# Altium project PCB_Project_1.PrjPcb
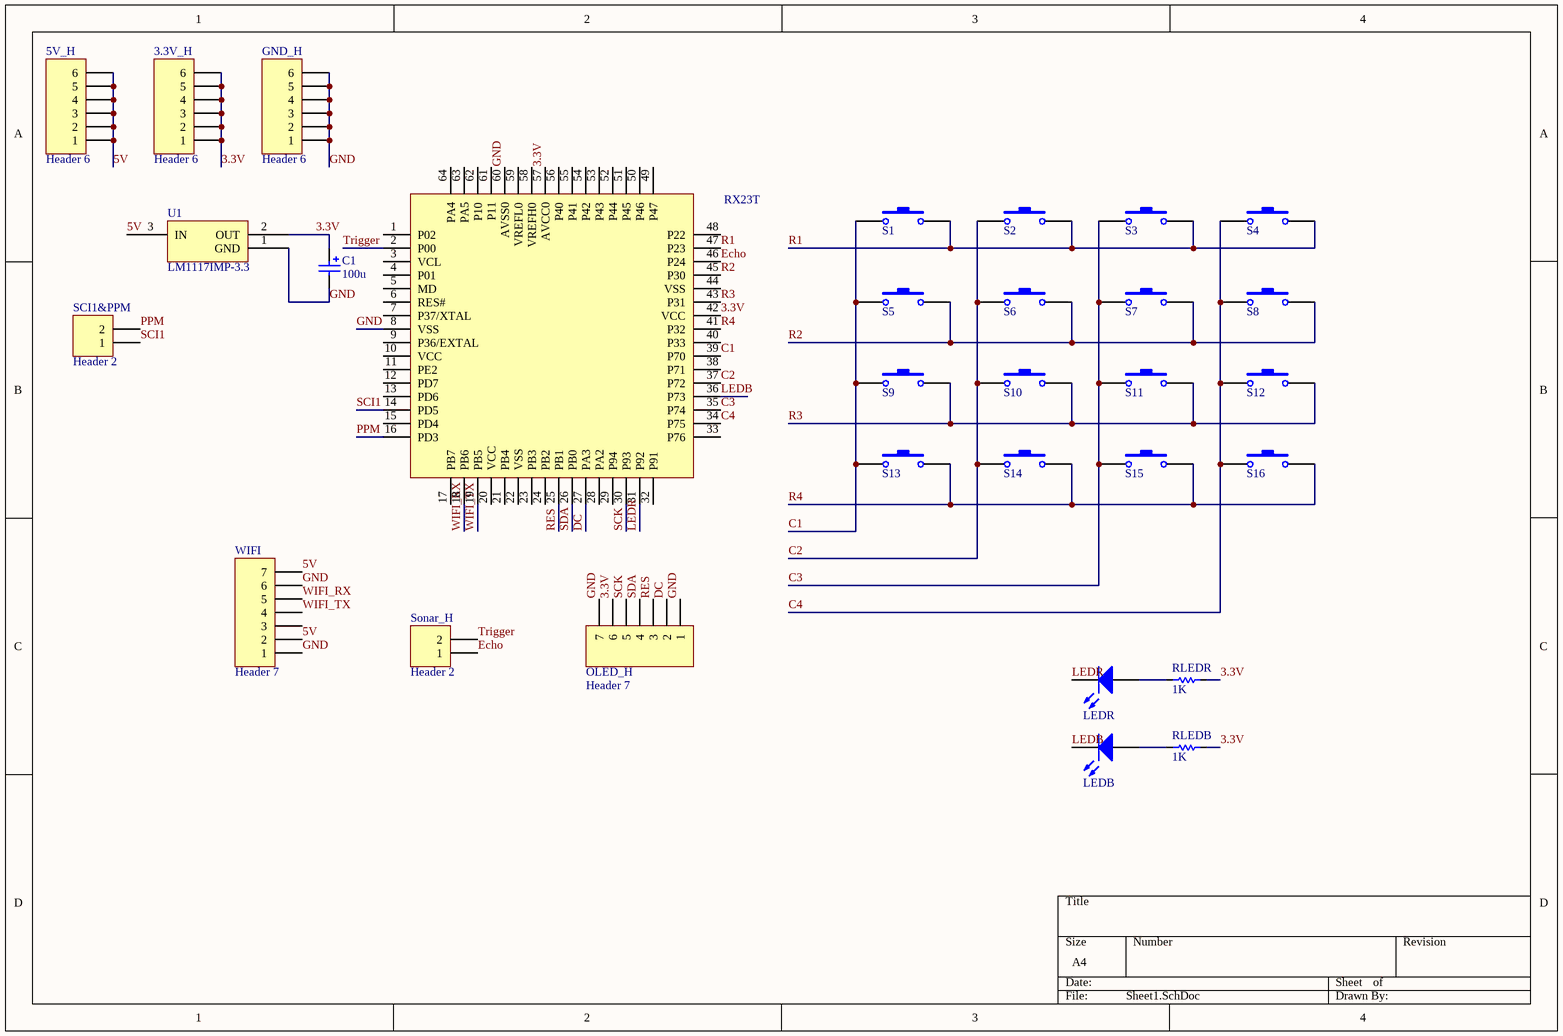
[diagram p0: Sheet1.SchDoc]
1 sheet, 30 parts. Net scope: global (net labels, ports and power ports of the same name join across sheets).
Board file: PCB1.PcbDoc

## Sheet Sheet1.SchDoc
size A4

### Parts
3.3V_H  Header 6  [HDR1X6]
5V_H  Header 6  [HDR1X6]
C1  value 100u  [CAP 2.5*5*11]  (hidden comment: Cap Pol3)
GND_H  Header 6  [HDR1X6]
LEDB  LED  [LED 3MM-R]  (value not drawn)
LEDR  LED  [LED 3MM-R]  (value not drawn)
OLED_H  Header 7  [HDR1X7]
RLEDB  1K  [RS 1/4W]
RLEDR  1K  [RS 1/4W]
RX23T  RX23T  [RFR]  (value not drawn)
S1  贴片轻触开关  [SW-6*6]  (value not drawn)
S2  贴片轻触开关  [SW-6*6]  (value not drawn)
S3  贴片轻触开关  [SW-6*6]  (value not drawn)
S4  贴片轻触开关  [SW-6*6]  (value not drawn)
S5  贴片轻触开关  [SW-6*6]  (value not drawn)
S6  贴片轻触开关  [SW-6*6]  (value not drawn)
S7  贴片轻触开关  [SW-6*6]  (value not drawn)
S8  贴片轻触开关  [SW-6*6]  (value not drawn)
S9  贴片轻触开关  [SW-6*6]  (value not drawn)
S10  贴片轻触开关  [SW-6*6]  (value not drawn)
S11  贴片轻触开关  [SW-6*6]  (value not drawn)
S12  贴片轻触开关  [SW-6*6]  (value not drawn)
S13  贴片轻触开关  [SW-6*6]  (value not drawn)
S14  贴片轻触开关  [SW-6*6]  (value not drawn)
S15  贴片轻触开关  [SW-6*6]  (value not drawn)
S16  贴片轻触开关  [SW-6*6]  (value not drawn)
SCI1&PPM  Header 2  [HDR1X2]
Sonar_H  Header 2  [HDR1X2]
U1  LM1117IMP-3.3  [SOT223_M]
WIFI  Header 7  [HDR1X7]

### Nets
3.3V: 3.3V_H.1 3.3V_H.2 3.3V_H.3 3.3V_H.4 3.3V_H.5 3.3V_H.6 C1.1 OLED_H.6 RLEDB.2 RLEDR.2 RX23T.42(VCC) RX23T.57(AVCC0) U1.2(OUT)
5V: 5V_H.1 5V_H.2 5V_H.3 5V_H.4 5V_H.5 5V_H.6 U1.3(IN) WIFI.2 WIFI.7
C1: RX23T.39(P70) S1.1 S5.1 S9.1 S13.1
C2: RX23T.37(P72) S2.1 S6.1 S10.1 S14.1
C3: RX23T.35(P74) S3.1 S7.1 S11.1 S15.1
C4: RX23T.34(P75) S4.1 S8.1 S12.1 S16.1
DC: OLED_H.2 RX23T.27(PA3)
Echo: RX23T.46(P24) Sonar_H.1
GND: C1.2 GND_H.1 GND_H.2 GND_H.3 GND_H.4 GND_H.5 GND_H.6 OLED_H.1 OLED_H.7 RX23T.8(VSS) RX23T.60(AVSS0) U1.1(GND) WIFI.1 WIFI.6
LEDB: LEDB.2 RX23T.36(P73)
LEDR: LEDR.2 RX23T.31(P92)
PPM: RX23T.16(PD3) SCI1&PPM.2
R1: RX23T.47(P23) S1.2 S2.2 S3.2 S4.2
R2: RX23T.45(P30) S5.2 S6.2 S7.2 S8.2
R3: RX23T.43(P31) S9.2 S10.2 S11.2 S12.2
R4: RX23T.41(P32) S13.2 S14.2 S15.2 S16.2
RES: OLED_H.3 RX23T.25(PB1)
SCI1: RX23T.14(PD5) SCI1&PPM.1
SCK: OLED_H.5 RX23T.30(P93)
SDA: OLED_H.4 RX23T.26(PB0)
Trigger: RX23T.2(P00) Sonar_H.2
WIFI_RX: RX23T.18(PB6) WIFI.5
WIFI_TX: RX23T.19(PB5) WIFI.4
NetLEDB_1: LEDB.1 RLEDB.1
NetLEDR_1: LEDR.1 RLEDR.1

Not connected (* = marked no-connect by the designer): RX23T 1(P02) 3(VCL) 4(P01) 5(MD) 6(RES#) 7(P37/XTAL) 9(P36/EXTAL) 10(VCC) 11(PE2) 12(PD7) 13(PD6) 15(PD4) 17(PB7) 20(VCC) 21(PB4) 22(VSS) 23(PB3) 24(PB2) 28(PA2) 29(P94) 32(P91) 33(P76) 38(P71) 40(P33) 44(VSS) 48(P22) 49(P47) 50(P46) 51(P45) 52(P44) 53(P43) 54(P42) 55(P41) 56(P40) 58(VREFH0) 59(VREFL0) 61(P11) 62(P10) 63(PA5) 64(PA4); WIFI 3

### Library data of the parts
3.3V_H 5V_H GND_H = Header 6: Header, 6-Pin; LatestRevisionDate: 17-Jul-2002; LatestRevisionNote: Re-released for DXP Platform.; Publisher: Altium Limited
C1 = Cap Pol3: Polarized Capacitor (Surface Mount); Published: 8-Jun-2000; LatestRevisionDate: 29-May-2009; LatestRevisionNote: IPC-7351 Footprint Added.; PackageReference: C0805; Publisher: Altium Limited; PackageDescription: Chip Capacitor
OLED_H WIFI = Header 7: Header, 7-Pin; LatestRevisionDate: 17-Jul-2002; LatestRevisionNote: Re-released for DXP Platform.; Publisher: Altium Limited
RLEDB RLEDR = R: R_0603
SCI1&PPM Sonar_H = Header 2: Header, 2-Pin; LatestRevisionDate: 17-Jul-2002; LatestRevisionNote: Re-released for DXP Platform.; Publisher: Altium Limited
U1 = Component_1_1